# Altium schematic sheet SCH3_Main_Computer_Eth.SchDoc: Main Computer - Ethernet
size B; Organization: CWRUbotix; Address1: 10900 Euclid Avenue; Address2: Cleveland, OH 44106; Address3: USA; Revision: 1.0; SheetNumber: 3; SheetTotal: 13
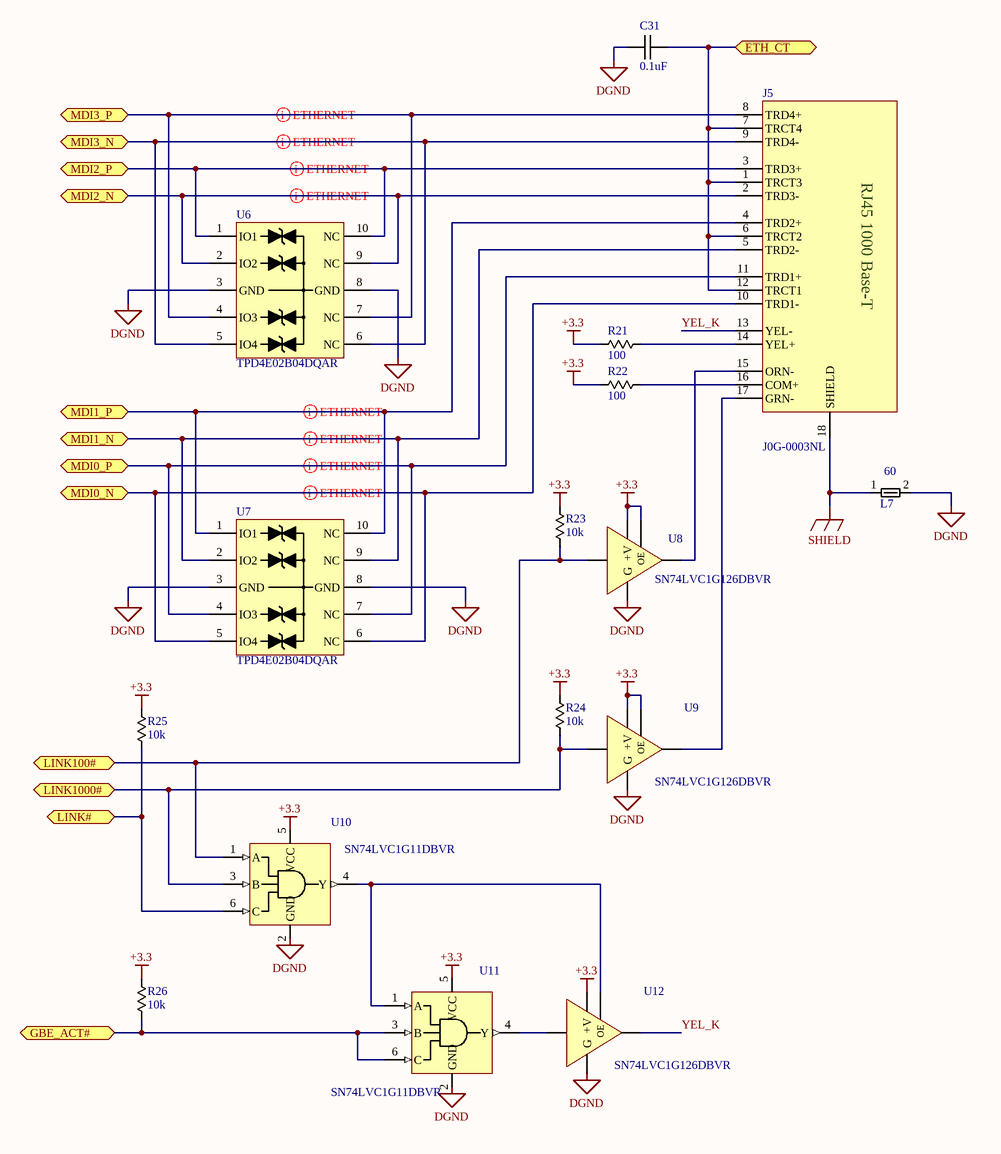
[diagram p0: SCH3_Main_Computer_Eth.SchDoc]

## Parts
C31  0.1uF  [chip_0603]
J5  J0G-0003NL  [J0G-0003NL]
L7  Impedance: 60  [CHIP_0805_FE]  (hidden comment: bead_0)
R21  100  [chip_0603]
R22  100  [chip_0603]
R23  10k  [chip_0603]
R24  10k  [chip_0603]
R25  10k  [chip_0603]
R26  10k  [chip_0603]
U6  TPD4E02B04DQAR  [USON-10]
U7  TPD4E02B04DQAR  [USON-10]
U8  SN74LVC1G126DBVR  [sot-23-5]
U9  SN74LVC1G126DBVR  [sot-23-5]
U10  SN74LVC1G11DBVR  [sot-23-6]
U11  SN74LVC1G11DBVR  [sot-23-6]
U12  SN74LVC1G126DBVR  [sot-23-5]

## Ports
ETH_CT (bidir), GBE_ACT# (bidir), LINK100# (bidir), LINK1000# (bidir), LINK# (bidir), MDI0_N (bidir), MDI0_P (bidir), MDI1_N (bidir), MDI1_P (bidir), MDI2_N (bidir), MDI2_P (bidir), MDI3_N (bidir), MDI3_P (bidir)

## Nets
+3.3: R21.1 R22.1 R23.1 R24.1 R25.1 R26.1 U8.1(OE) U8.5(+V) U9.1(OE) U9.5(+V) U10.5(VCC) U11.5(VCC) U12.5(+V)
DGND: C31.1 L7.2 U6.3(GND) U6.8(GND) U7.3(GND) U7.8(GND) U8.3(G) U9.3(G) U10.2(GND) U11.2(GND) U12.3(G)
SHIELD: J5.18(SHIELD) L7.1
ETH_CT: C31.2 J5.1(TRCT3) J5.6(TRCT2) J5.7(TRCT4) J5.12(TRCT1) ; port ETH_CT
GBE_ACT#: R26.2 U11.3(B) U11.6(C) ; port GBE_ACT#
LINK100#: R23.2 U8.2(A) U10.1(A) ; port LINK100#
LINK1000#: R24.2 U9.2(A) U10.3(B) ; port LINK1000#
LINK#: R25.2 U10.6(C) ; port LINK#
MDI0_N: J5.10(TRD1-) U7.5(IO4) U7.6(NC) ; port MDI0_N
MDI0_P: J5.11(TRD1+) U7.4(IO3) U7.7(NC) ; port MDI0_P
MDI1_N: J5.5(TRD2-) U7.2(IO2) U7.9(NC) ; port MDI1_N
MDI1_P: J5.4(TRD2+) U7.1(IO1) U7.10(NC) ; port MDI1_P
MDI2_N: J5.2(TRD3-) U6.2(IO2) U6.9(NC) ; port MDI2_N
MDI2_P: J5.3(TRD3+) U6.1(IO1) U6.10(NC) ; port MDI2_P
MDI3_N: J5.9(TRD4-) U6.5(IO4) U6.6(NC) ; port MDI3_N
MDI3_P: J5.8(TRD4+) U6.4(IO3) U6.7(NC) ; port MDI3_P
YEL_K: J5.13(YEL-) U12.4(Y)
NetJ5_14: J5.14(YEL+) R21.2
NetJ5_15: J5.15(ORN-) U8.4(Y)
NetJ5_16: J5.16(COM+) R22.2
NetJ5_17: J5.17(GRN-) U9.4(Y)
NetU10_4: U10.4(Y) U11.1(A) U12.1(OE)
NetU11_4: U11.4(Y) U12.2(A)

## Layout directives
differential pair: MDI0_N, MDI0_P, MDI1_N, MDI1_P, MDI2_N, MDI2_P, MDI3_N, MDI3_P

## Notes on the sheet
- Title
- Size:
- B
- Number:
- Revision:
- Date:
- Sheet
- of
- (in symbol CONN-00082) RJ45 1000 Base-T

## Library data of the parts
C31 = CAP-00542: CAP, 0.1uF, ±10%, 16V, X7R, 0603; Manufacturer: Murata; Part Number: CAP-00542; Capacitance: 0.1uF; Tolerance: ±10%; Voltage Rating: 16V; Type: X7R
J5 = CONN-00082: RJ45 Modular Mag-jack, 8P8C, 1000 Base-T, Horizontal; Manufacturer: Pulse Electronics Network; Positions per level: 8; Levels: 1; Part Number: CONN-00082; Type: Jack; Manufacturer PN: J0G-0003NL; Cost: 10.26
L7 = MAG-00125: Fe Bead, 60 @ 100MH, 3A, 0805; Manufacturer: Pulse Electronics; Manufacturer PN: PE-0805PFB600ST; Test Freq: 100MHz; DCR: 25mOhm; Part Number: MAG-00125; Current Rating: 3A; Cost: 0.1
R21 R22 = RES-00178: RES SMD 100 OHM 1% 1/4W 0603; Manufacturer: Panasonic; Manufacturer PN: ERJ-PA3F1000V; Power Rating: 0.25W; Part Number: RES-00178; Resistance: 100; Tolerance: 1%
R23-R26 = RES-00306: RES SMD 10K OHM 1% 1/4W 0603; Manufacturer: Panasonic; Manufacturer PN: ERJ-PA3F1002V; Power Rating: 0.25W; Part Number: RES-00306; Resistance: 10k; Tolerance: 1%; Cost: 0.144
U6 U7 = DIO-00068: TVS, 4-Ch, ESD Protec, 3.6V 8.8V 10-USON; Manufacturer: TI; Power Rating: 17W; Current Rating: 2A; Part Number: DIO-00068; Type: TVS; Manufacturer PN: TPD4E02B04DQAR; Cost: 0.56
U8 U9 U12 = LOGIC-00040: IC, Tri-State Buffer Non-Inverting, Single, 1.65-5.5V, SOT-23-5; Manufacturer: TI; Part Number: LOGIC-00040; Manufacturer PN: SN74LVC1G126DBVR; Cost: $0.32
U10 U11 = LOGIC-00042: IC, AND Gate, Single 3-Input, 1.65-5.5V, SOT-23-6; Manufacturer: TI; Part Number: LOGIC-00042; Manufacturer PN: SN74LVC1G11DBVR; Cost: $0.37